# Altium schematic sheet rl78l1a_smart_blood_pressure_monitor_sch1.SchDoc: RL78/L1A Smart Blood Pressure Monitor
size A4; Date: 2017/6/1; Author: Renesas Electronics; SheetNumber: 1; SheetTotal: 2; PageSetup: Record=PageOptions|CenterHorizontal=True|CenterVertical=True|PrintScale=0.97|XCorrection=1.00|YCorrection=1.00|PrintKind=1|BorderSize=5000000|LeftOffset=0|BottomOffset=0|Orientation=2|PaperLength=2970|PaperWidth=2100|Scale=100|PaperSource=7|PrintQuality=600|MediaType=1|DitherType=10|PaperKind=A4 (210 x 297 mm)|PrintScaleMode=1; Company: Renesas Electronics (China) Co.,Ltd; Rev: Rev 1.00
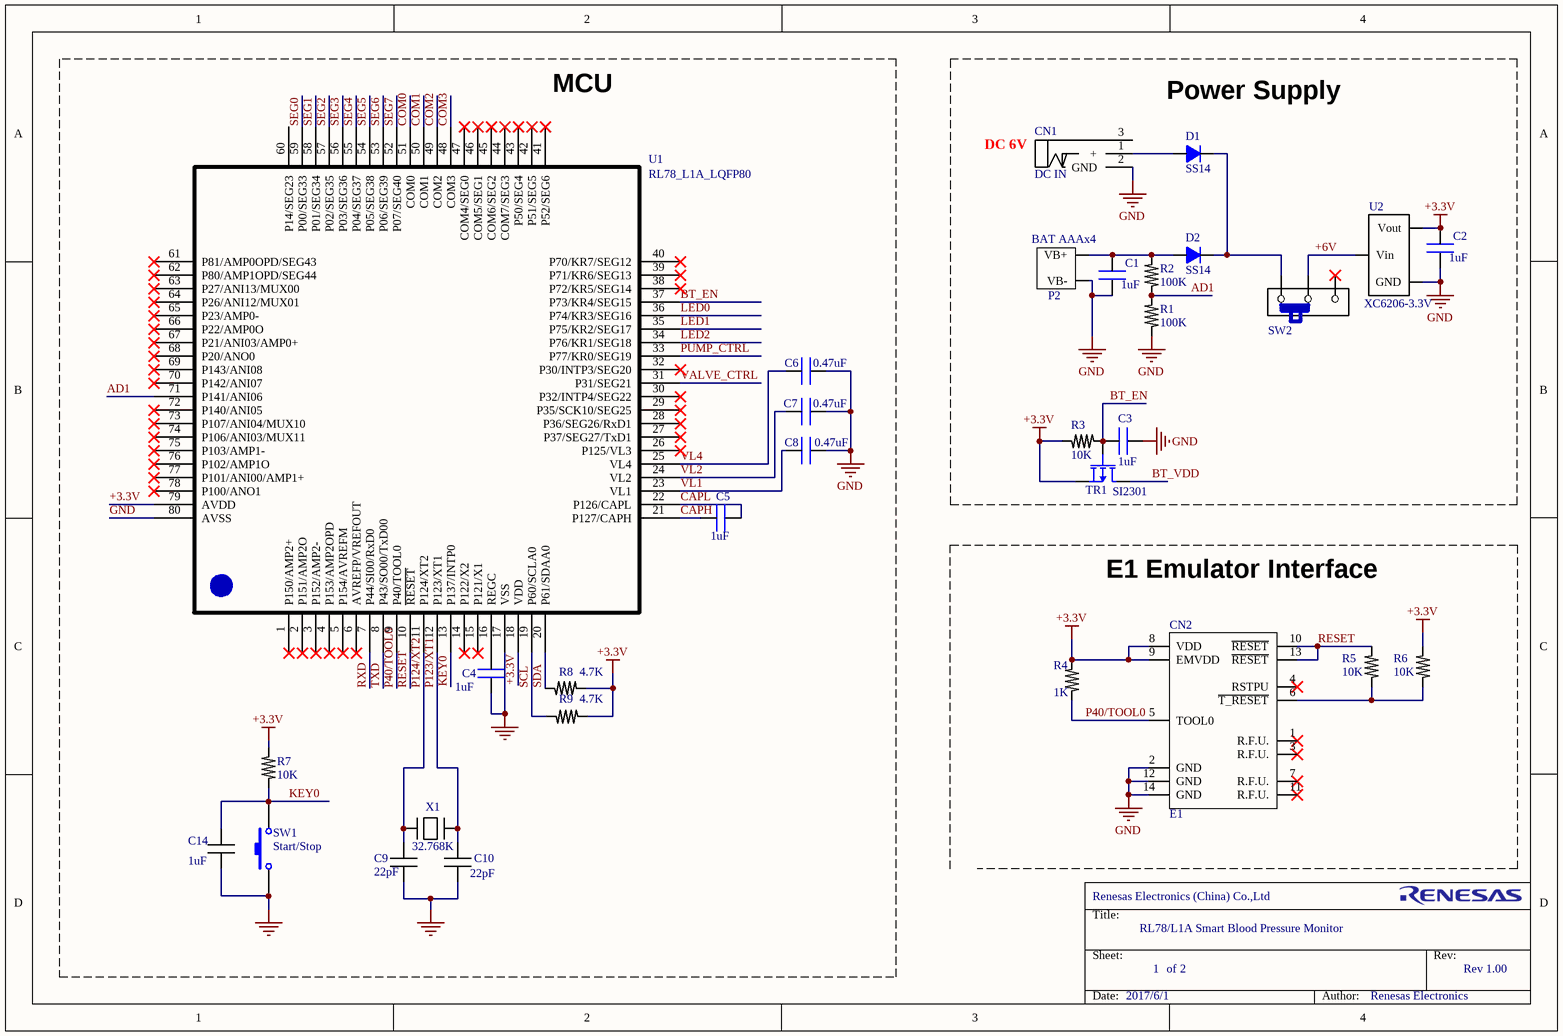
[diagram p0: rl78l1a_smart_blood_pressure_monitor_sch1.SchDoc]

## Parts
C1  1uF  [0603]
C2  1uF  [0603]
C3  1uF  [0603]
C4  1uF  [0603]
C5  1uF  [0805]
C6  0.47uF  [0805]
C7  0.47uF  [0805]
C8  0.47uF  [0805]
C9  22pF  [0805]
C10  22pF  [0805]
C14  1uF  [0603]
CN1  DC IN  [POWER IN A]
D1  SS14  [D1N]
D2  SS14  [D1N]
E1  CN2  [E8 Connect]
P2  BAT AAAx4  [CON-2MM-2]
R1  100K  [0603]
R2  100K  [0603]
R3  10K  [0603]
R4  1K  [0603]
R5  10K  [0603]
R6  10K  [0603]
R7  10K  [0603]
R8  4.7K  [0603]
R9  4.7K  [0603]
SW1  Start/Stop  [KEY SMT (6 X 6)]
SW2  SWITCH  [SW-1 C]  (value not drawn)
TR1  SI2301  [SOT-23-3 B]
U1  RL78_L1A_LQFP80  [LQFP-80]
U2  XC6206-3.3V  [SOT23A]
X1  32.768K  [OSC 32K SMT]

## Blocks framed on the sheet
MCU: C4-C10 C14 R7-R9 SW1 U1 X1
Power Supply: C1-C3 CN1 D1 D2 P2 R1-R3 SW2 TR1 U2

## Nets
+3.3V: C2.1 E1.8(VDD) E1.9(EMVDD) R3.1 R4.1 R6.1 R7.2 R8.2 R9.2 TR1.2(S) U1.18(VDD) U1.79(AVDD) U2.2(Vout)
GND: C1.2 C2.2 C3.2 C4.2 C6.2 C7.2 C8.2 C9.1 C10.1 C14.1 CN1.2(GND) E1.2(GND) E1.12(GND) E1.14(GND) P2.2(VB-) R1.1 SW1.1 U1.17(VSS) U1.80(AVSS) U2.1(GND)
+6V: SW2.2 U2.3(Vin)
AD1: R1.2 R2.1 U1.71(P141/ANI06)
BT_EN: C3.1 R3.2 TR1.1(G) U1.37(P73/KR4/SEG15)
BT_VDD: TR1.3(D)
CAPH: C5.1 U1.21(P127/CAPH)
CAPL: C5.2 U1.22(P126/CAPL)
COM0: U1.51(COM0)
COM1: U1.50(COM1)
COM2: U1.49(COM2)
COM3: U1.48(COM3)
KEY0: C14.2 R7.1 SW1.2 U1.13(P137/INTP0)
LED0: U1.36(P74/KR3/SEG16)
LED1: U1.35(P75/KR2/SEG17)
LED2: U1.34(P76/KR1/SEG18)
P40/TOOL0: E1.5(TOOL0) R4.2 U1.9(P40/TOOL0)
P123/XT1: C10.2 U1.12(P123/XT1) X1.1
P124/XT2: C9.2 U1.11(P124/XT2) X1.2
PUMP_CTRL: U1.33(P77/KR0/SEG19)
RESET: E1.10(~{RESET}) E1.13(~{RESET}) R5.1 U1.10(~{RESET})
RXD: U1.7(P44/SI00/RxD0)
SCL: R9.1 U1.19(P60/SCLA0)
SDA: R8.1 U1.20(P61/SDAA0)
SEG0: U1.59(P00/SEG33)
SEG1: U1.58(P01/SEG34)
SEG2: U1.57(P02/SEG35)
SEG3: U1.56(P03/SEG36)
SEG4: U1.55(P04/SEG37)
SEG5: U1.54(P05/SEG38)
SEG6: U1.53(P06/SEG39)
SEG7: U1.52(P07/SEG40)
TXD: U1.8(P43/SO00/TxD00)
VALVE_CTRL: U1.31(P31/SEG21)
VL1: C8.1 U1.23(VL1)
VL2: C7.1 U1.24(VL2)
VL4: C6.1 U1.25(VL4)
NetC1_1: C1.1 D2.A P2.1(VB+) R2.2
NetC4_1: C4.1 U1.16(REGC)
NetCN1_1: CN1.1(+) D1.A
NetD1_K: D1.K D2.K SW2.1
NetE1_6: E1.6(~{T_RESET}) R5.2 R6.2

Not connected (* = marked no-connect by the designer): CN1 3(C); E1 1(R.F.U.)* 3(R.F.U.)* 4(RSTPU)* 7(R.F.U.)* 11(R.F.U.)*; SW2 3*; U1 1(P150/AMP2+)* 2(P151/AMP2O)* 3(P152/AMP2-)* 4(P153/AMP2OPD)* 5(P154/AVREFM)* 6(AVREFP/VREFOUT)* 14(P122/X2)* 15(P121/X1)* 26(P125/VL3)* 27(P37/SEG27/TxD1)* 28(P36/SEG26/RxD1)* 29(P35/SCK10/SEG25)* 30(P32/INTP4/SEG22)* 32(P30/INTP3/SEG20)* 38(P72/KR5/SEG14)* 39(P71/KR6/SEG13)* 40(P70/KR7/SEG12)* 41(P52/SEG6)* 42(P51/SEG5)* 43(P50/SEG4)* 44(COM7/SEG3)* 45(COM6/SEG2)* 46(COM5/SEG1)* 47(COM4/SEG0)* 60(P14/SEG23) 61(P81/AMP0OPD/SEG43)* 62(P80/AMP1OPD/SEG44)* 63(P27/ANI13/MUX00)* 64(P26/ANI12/MUX01)* 65(P23/AMP0-)* 66(P22/AMP0O)* 67(P21/ANI03/AMP0+)* 68(P20/ANO0)* 69(P143/ANI08)* 70(P142/ANI07)* 72(P140/ANI05)* 73(P107/ANI04/MUX10)* 74(P106/ANI03/MUX11)* 75(P103/AMP1-)* 76(P102/AMP1O)* 77(P101/ANI00/AMP1+)* 78(P100/ANO1)*

## Notes on the sheet
- DC 6V
- E1 Emulator Interface
- Title:
- Sheet:
- of
- Rev:
- Date:
- Author:

## Library data of the parts
C1-C10 C14 = CAP
D1 D2 = 1SS404
E1 = E1
P2 = Cell Battery: Header, 4-Pin; LatestRevisionDate: 17-Jul-2002; LatestRevisionNote: Re-released for DXP Platform.; Publisher: Altium Limited
R1-R9 = RES
SW1 = SW-PB: Switch; Published: 24-Mar-1999; LatestRevisionDate: 17-Jul-2002; LatestRevisionNote: Re-released for DXP Platform.; PackageReference: SPST-2; Publisher: Altium Limited
TR1 = PL2301
U2 = XC6206
X1 = OSC 2PIN